# EAGLE design EncConn2 (EAGLE 9.1.3)
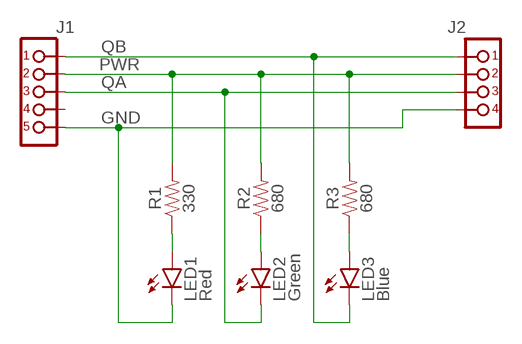
[diagram p0: schematic, sheet 1]

## Parts
J1  HDR-5  [POST1X5]
J2  HDR-4NYLON-4  [NYLON-4]
LED1  Red  LEDSML0805  [SML0805]
LED2  Green  LEDSML0805  [SML0805]
LED3  Blue  LEDSML0805  [SML0805]
R1  330  0.3OHM-0805-1/8W-1%  [0805]
R2  680  0.3OHM-0805-1/8W-1%  [0805]
R3  680  0.3OHM-0805-1/8W-1%  [0805]

## Nets
GND: J1.5 J2.P$4 LED1.C
N$1: LED1.A R1.1
N$2: LED3.A R3.1
N$3: LED2.A R2.1
PWR: J1.2 J2.P$2 R1.2 R2.2 R3.2
QA: J1.3 J2.P$3 LED2.C
QB: J1.1 J2.P$1 LED3.C
Unconnected: J1.4

## Library data of the parts
J1 = Team4415:HDR-5
J2 = Team4415:HDR-4
LED1-LED3 = led:LED: LED OSRAM: - CHIPLED LG R971, LG N971, LY N971, LG Q971, LY Q971, LO R971, LY R971 LH N974, LH R974 LS Q976, LO Q976, LY Q976 LO Q996 - Hyper CHIPLED LW Q18S LB Q993, LB Q99A, LB R99A - SideLED LS A670, LO A670, LY A670, LG A670, LP A670 LB A673, LV A673, LT A673, LW A673 LH A674 LY A675 LS A676, LA A676, LO A676, LY A676, LW A676 LS A679, LY A679, LG A679 - Hyper Micro SIDELED® LS Y876, LA Y876, LO Y876, LY Y876 LT Y87S - SmartLED LW L88C, LW L88S LB L89C, LB L89S, LG L890 LS L89K, LO L89K, LY L89K LS L896, LA L896, LO L896, LY L896 - TOPLED LS T670, LO T670, LY T670, LG T670, LP T670 LSG T670, LSP T670, LSY T670, LOP T670, LYG T670 LG T671, LOG T671, LSG T671 LB T673, LV T673, LT T673, LW T673 LH T674 LS T676, LA T676, LO T676, LY T676, LB T676, LH T676, LSB T676, LW T676 LB T67C, LV T67C, LT T67C, LS T67K, LO T67K, LY T67K, LW E67C LS E67B, LA E67B, LO E67B, LY E67B, LB E67C, LV E67C, LT E67C LW T67C LS T679, LY T679, LG T679 LS T770, LO T770, LY T770, LG T770, LP T770 LB T773, LV T773, LT T773, LW T773 LH T774 LS E675, LA E675, LY E675, LS T675 LS T776, LA T776, LO T776, LY T776, LB T776 LHGB T686 LT T68C, LB T68C - Hyper Mini TOPLED® LB M676 - Mini TOPLED Santana® LG M470 LS M47K, LO M47K, LY M47K Source: http://www.osram.convergy.de LUXEON: - LUMILED® LXK2-PW12-R00, LXK2-PW12-S00, LXK2-PW14-U00, LXK2-PW14-V00 LXK2-PM12-R00, LXK2-PM12-S00, LXK2-PM14-U00 LXK2-PE12-Q00, LXK2-PE12-R00, LXK2-PE12-S00, LXK2-PE14-T00, LXK2-PE14-U00 LXK2-PB12-K00, LXK2-PB12-L00, LXK2-PB12-M00, LXK2-PB14-N00, LXK2-PB14-P00, LXK2-PB14-Q00 LXK2-PR12-L00, LXK2-PR12-M00, LXK2-PR14-Q00, LXK2-PR14-R00 LXK2-PD12-Q00, LXK2-PD12-R00, LXK2-PD12-S00 LXK2-PH12-R00, LXK2-PH12-S00 LXK2-PL12-P00, LXK2-PL12-Q00, LXK2-PL12-R00 Source: www.luxeon.com KINGBRIGHT: KA-3528ASYC Source: www.kingbright.com
R1-R3 = SparkFun-Resistors:0.3OHM: 0.3Ω resistor A resistor is a passive two-terminal electrical component that implements electrical resistance as a circuit element. Resistors act to reduce current flow, and, at the same time, act to lower voltage levels within circuits. - Wikipedia; PROD_ID: RES-11622; VALUE: 0.3

## Board
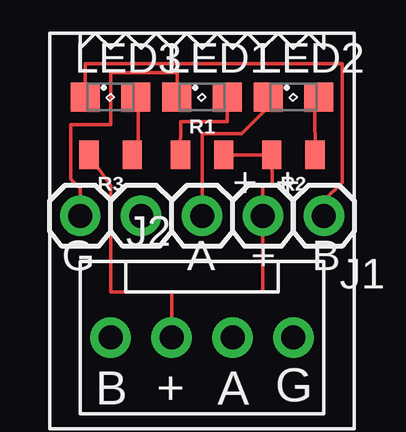
[diagram p1: board, top side]
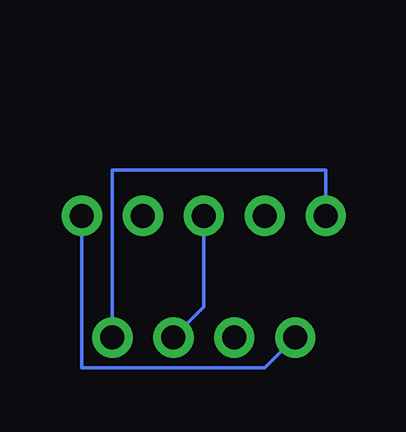
[diagram p2: board, bottom side, seen from below]

No outline drawn. Coordinates in mm, seen from the top.
Copper layers (1*16): Top 0.035mm / dielectric 1.5mm / Bottom 0.035mm
Design rules "default": minimum track width 6mil, minimum drill 0.35mm, track to track 6mil, track to pad 6mil, pad to pad 6mil, via to via 6mil, smd to smd 6mil, copper to edge 40mil, drill to drill 6mil, minimum pad ring 10mil, minimum via ring 8mil, stop-mask expansion 4mil, vias tented up to drill 0mil, thermal gap 10mil

### Footprints (pad centres in the part's own frame; a part is rotated, then mirrored left to right if it is on the bottom)
POST1X5 = drill 1 pad 1.676: 1 0,0; 2 2.54,0; 3 5.08,0; 4 7.62,0; 5 10.16,0
NYLON-4 = drill 1 pad 1.676: P$1 0,0; P$2 2.54,0; P$3 5.08,0; P$4 7.62,0
SML0805 = smd 1.2 x 1.2: A 1.05,0; C -1.05,0
0805 = smd 0.8 x 1.2: 1 -0.9,0; 2 0.9,0

### Placement (x,y rotation side)
J1  11.43,8.89 180 top
J2  2.54,3.81 0 top
LED1  6.35,13.84 0 top
LED2  10.16,13.84 0 top
LED3  2.54,13.84 0 top
R1  6.35,11.43 0 top
R2  10.16,11.43 180 top
R3  2.54,11.43 180 top

### Tracks (layer width: path | path; a pad name or v marks a point on that pad's centre or on a via)
GND
  Top 0.152: J1.5 1.27,10.03 0.89,10.41 0.89,12.7 2.54,12.7 2.54,14.86 5.33,14.86 LED1.C
  Bottom 0.152: J2.P$4 10.16,10.79 1.27,10.79 J1.5
N$1
  Top 0.152: LED1.A 7.4,12.83 5.71,12.83 5.46,12.83 R1.1
N$2
  Top 0.152: 3.69,13.59 3.69,11.68 R3.1
N$3
  Top 0.152: R2.1 11.05,13.34 LED2.A
PWR
  Top 0.152: 5.08,5.71 2.54,5.71 2.54,10.16 R3.2 | 5.08,5.71 J2.P$2 | R1.2 R2.2 9.27,10.16 8.89,10.16 J1.2 8.89,5.71 5.08,5.71
QA
  Top 0.152: J1.3 6.35,12.32 8,12.32 9.14,13.46 9.11,13.5 LED2.C
  Bottom 0.152: J2.P$3 6.35,5.08 J1.3
QB
  Top 0.152: LED3.C 1.49,15.24 12.19,15.24 12.19,10.67 12.19,10.29 11.43,9.53 J1.1
  Bottom 0.152: J1.1 11.43,6.99 11.43,2.54 3.81,2.54 J2.P$1

### Text on the board
tSilk: + | + | G | A | + | B | B | + | A | G